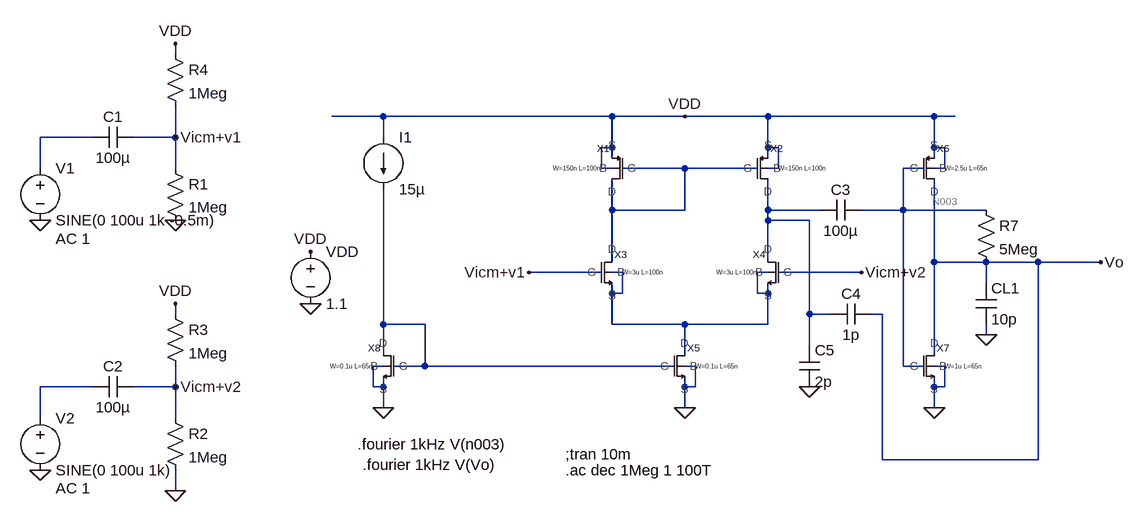
[diagram p0: schematic Draft21.asc]
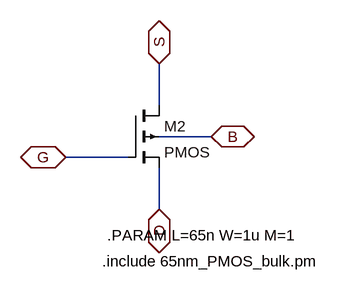
[diagram p1: sub-circuit pmos65.asc]
Draft21.asc, the LTspice schematic file:
Version 4
SHEET 1 1288 680
WIRE -240 -160 -240 -176
WIRE 80 -64 0 -64
WIRE 432 -64 80 -64
WIRE 544 -64 432 -64
WIRE 672 -64 544 -64
WIRE 928 -64 672 -64
WIRE 960 -64 928 -64
WIRE -368 -32 -448 -32
WIRE -240 -32 -240 -80
WIRE -240 -32 -304 -32
WIRE 80 -32 80 -64
WIRE 432 -16 432 -64
WIRE 432 -16 416 -16
WIRE 672 -16 672 -64
WIRE 688 -16 672 -16
WIRE 928 -16 928 -64
WIRE 944 -16 928 -16
WIRE 432 0 432 -16
WIRE 672 0 672 -16
WIRE 928 0 928 -16
WIRE -448 16 -448 -32
WIRE -240 16 -240 -32
WIRE 416 16 416 -16
WIRE 432 16 416 16
WIRE 544 16 448 16
WIRE 656 16 544 16
WIRE 688 16 688 -16
WIRE 688 16 672 16
WIRE 912 16 880 16
WIRE 944 16 944 -16
WIRE 944 16 928 16
WIRE 432 80 432 32
WIRE 544 80 544 16
WIRE 544 80 432 80
WIRE 672 80 672 32
WIRE 752 80 672 80
WIRE 880 80 880 16
WIRE 880 80 816 80
WIRE 1008 80 880 80
WIRE 672 96 672 80
WIRE 736 96 672 96
WIRE 432 160 432 80
WIRE 672 160 672 96
WIRE 928 160 928 32
WIRE 1008 160 928 160
WIRE 1088 160 1008 160
WIRE 1184 160 1088 160
WIRE 416 176 304 176
WIRE 448 176 432 176
WIRE 672 176 656 176
WIRE 816 176 688 176
WIRE 1008 192 1008 160
WIRE 432 208 432 192
WIRE 448 208 448 176
WIRE 448 208 432 208
WIRE 656 208 656 176
WIRE 672 208 672 192
WIRE 672 208 656 208
WIRE -240 240 -240 224
WIRE 736 240 736 96
WIRE 768 240 736 240
WIRE 848 240 832 240
WIRE 80 256 80 48
WIRE 144 256 80 256
WIRE 432 256 432 208
WIRE 544 256 432 256
WIRE 672 256 672 208
WIRE 672 256 544 256
WIRE 1008 272 1008 256
WIRE 736 288 736 240
WIRE 80 304 80 256
WIRE 544 304 544 256
WIRE 928 304 928 160
WIRE 80 320 64 320
WIRE 144 320 144 256
WIRE 144 320 96 320
WIRE 528 320 144 320
WIRE 560 320 544 320
WIRE 880 320 880 80
WIRE 912 320 880 320
WIRE 944 320 928 320
WIRE -368 352 -448 352
WIRE -240 352 -240 320
WIRE -240 352 -304 352
WIRE 64 352 64 320
WIRE 80 352 80 336
WIRE 80 352 64 352
WIRE 544 352 544 336
WIRE 560 352 560 320
WIRE 560 352 544 352
WIRE 928 352 928 336
WIRE 944 352 944 320
WIRE 944 352 928 352
WIRE 80 384 80 352
WIRE 544 384 544 352
WIRE 928 384 928 352
WIRE -448 400 -448 352
WIRE -240 400 -240 352
WIRE 848 464 848 240
WIRE 1088 464 1088 160
WIRE 1088 464 848 464
WIRE -240 512 -240 480
FLAG 544 384 0
FLAG 544 -64 VDD
FLAG 928 384 0
FLAG 1008 272 0
FLAG -448 96 0
FLAG -448 480 0
FLAG 304 176 Vicm+v1
FLAG 816 176 Vicm+v2
FLAG -240 96 0
FLAG -240 512 0
FLAG -240 -176 VDD
FLAG -240 224 VDD
FLAG -240 -32 Vicm+v1
FLAG -240 352 Vicm+v2
FLAG 80 384 0
FLAG -32 224 0
FLAG -32 144 VDD
FLAG 1184 160 Vo
FLAG 736 352 0
SYMBOL pmos65 416 16 M0
WINDOW 39 0 0 Left 0
SYMATTR SpiceLine W=150n L=100n
SYMATTR InstName X1
SYMBOL pmos65 688 16 R0
WINDOW 39 0 0 Left 0
SYMATTR SpiceLine W=150n L=100n
SYMATTR InstName X2
SYMBOL nmos65 448 176 R0
WINDOW 39 0 0 Left 0
SYMATTR SpiceLine W=3u L=100n
SYMATTR InstName X3
SYMBOL nmos65 656 176 M0
WINDOW 39 0 0 Left 0
SYMATTR SpiceLine W=3u L=100n
SYMATTR InstName X4
SYMBOL nmos65 560 320 R0
WINDOW 39 0 0 Left 0
SYMATTR SpiceLine W=0.1u L=65n
SYMATTR InstName X5
SYMBOL pmos65 944 16 R0
WINDOW 39 0 0 Left 0
SYMATTR SpiceLine W=2.5u L=65n
SYMATTR InstName X6
SYMBOL nmos65 944 320 R0
WINDOW 39 0 0 Left 0
SYMATTR SpiceLine W=1u L=65n
SYMATTR InstName X7
SYMBOL cap 992 192 R0
SYMATTR InstName CL1
SYMATTR Value 10p
SYMBOL voltage -448 0 R0
WINDOW 123 24 124 Left 2
WINDOW 39 0 0 Left 0
SYMATTR Value2 AC 1
SYMATTR InstName V1
SYMATTR Value SINE(0 100u 1k -0.5m)
SYMBOL cap -304 -48 R90
WINDOW 0 0 32 VBottom 2
WINDOW 3 32 32 VTop 2
SYMATTR InstName C1
SYMATTR Value 100µ
SYMBOL res -256 0 R0
SYMATTR InstName R1
SYMATTR Value 1Meg
SYMBOL voltage -448 384 R0
WINDOW 123 24 124 Left 2
WINDOW 39 0 0 Left 0
SYMATTR Value2 AC 1
SYMATTR InstName V2
SYMATTR Value SINE(0 100u 1k)
SYMBOL cap -304 336 R90
WINDOW 0 0 32 VBottom 2
WINDOW 3 32 32 VTop 2
SYMATTR InstName C2
SYMATTR Value 100µ
SYMBOL res -256 384 R0
SYMATTR InstName R2
SYMATTR Value 1Meg
SYMBOL res -256 224 R0
SYMATTR InstName R3
SYMATTR Value 1Meg
SYMBOL res -256 -176 R0
SYMATTR InstName R4
SYMATTR Value 1Meg
SYMBOL current 80 -32 R0
WINDOW 123 0 0 Left 0
WINDOW 39 0 0 Left 0
SYMATTR InstName I1
SYMATTR Value 15µ
SYMBOL nmos65 64 320 M0
WINDOW 39 0 0 Left 0
SYMATTR SpiceLine W=0.1u L=65n
SYMATTR InstName X8
SYMBOL voltage -32 128 R0
WINDOW 123 0 0 Left 0
WINDOW 39 0 0 Left 0
SYMATTR InstName VDD
SYMATTR Value 1.1
SYMBOL res 992 64 R0
SYMATTR InstName R7
SYMATTR Value 5Meg
SYMBOL cap 816 64 R90
WINDOW 0 0 32 VBottom 2
WINDOW 3 32 32 VTop 2
SYMATTR InstName C3
SYMATTR Value 100µ
SYMBOL cap 832 224 R90
WINDOW 0 0 32 VBottom 2
WINDOW 3 32 32 VTop 2
SYMATTR InstName C4
SYMATTR Value 1p
SYMBOL cap 720 288 R0
SYMATTR InstName C5
SYMATTR Value 2p
TEXT 360 480 Left 2 !.ac dec 1Meg 1 100T
TEXT 360 456 Left 2 !;tran 10m
TEXT 40 440 Left 2 !.fourier 1kHz V(n003)
TEXT 48 472 Left 2 !.fourier 1kHz V(Vo)

pmos65.asc, the sub-circuit schematic file:
Version 4
SHEET 1 880 680
WIRE 160 80 160 16
WIRE 240 128 160 128
WIRE 112 160 16 160
WIRE 160 240 160 176
FLAG 16 160 G
IOPIN 16 160 BiDir
FLAG 160 240 D
IOPIN 160 240 BiDir
FLAG 160 16 S
IOPIN 160 16 BiDir
FLAG 240 128 B
IOPIN 240 128 BiDir
SYMBOL pmos4 112 80 R0
SYMATTR InstName M2
SYMATTR Value2 l={L} w={W} ad='2*65n*{W}' as='2*65n*{W}' pd='2*(2*65n+{W})' ps='2*(2*65n+{W})' m={M}
TEXT 80 280 Left 2 !.PARAM L=65n W=1u M=1
TEXT 72 320 Left 2 !.include 65nm_PMOS_bulk.pm

The netlist it stands for:
* Draft21.asc
XX1 N002 N002 VDD VDD pmos65 params: W=150n L=100n
XX2 N002 N004 VDD VDD pmos65 params: W=150n L=100n
XX3 Vicm+v1 N002 N005 N005 nmos65 params: W=3u L=100n  ; pins G D S B
XX4 Vicm+v2 N004 N005 N005 nmos65 params: W=3u L=100n  ; pins G D S B
XX5 N006 N005 0 0 nmos65 params: W=0.1u L=65n  ; pins G D S B
XX6 N003 Vo VDD VDD pmos65 params: W=2.5u L=65n
XX7 N003 Vo 0 0 nmos65 params: W=1u L=65n  ; pins G D S B
CL1 Vo 0 10p
V1 N001 0 SINE(0 100u 1k -0.5m) AC 1
C1 Vicm+v1 N001 100µ
R1 Vicm+v1 0 1Meg
V2 N007 0 SINE(0 100u 1k) AC 1
C2 Vicm+v2 N007 100µ
R2 Vicm+v2 0 1Meg
R3 VDD Vicm+v2 1Meg
R4 VDD Vicm+v1 1Meg
I1 VDD N006 15µ
XX8 N006 N006 0 0 nmos65 params: W=0.1u L=65n  ; pins G D S B
VDD VDD 0 1.1
R7 N003 Vo 5Meg
C3 N003 N004 100µ
C4 Vo N004 1p
C5 N004 0 2p

* block symbol definitions
.subckt pmos65 G D S B
M2 S G D B PMOS l={L} w={W} ad='2*65n*{W}' as='2*65n*{W}' pd='2*(2*65n+{W})' ps='2*(2*65n+{W})' m={M}
.PARAM L=65n W=1u M=1
.include 65nm_PMOS_bulk.pm
.ends pmos65

.model NMOS NMOS
.model PMOS PMOS
.lib standard.mos
.ac dec 1Meg 1 100T
;tran 10m
.fourier 1kHz V(n003)
.fourier 1kHz V(Vo)
.backanno
.end